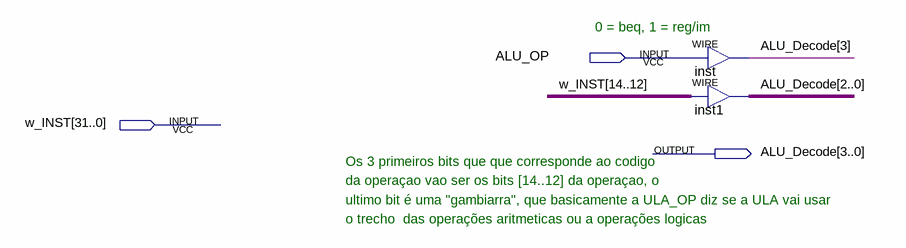
[diagram p0: schematic sheet]
// Quartus schematic ULA_Operador.bdf as structural Verilog: 2 symbols, 3 pins
module ULA_Operador (
  input  ALU_OP,
  input  [31:0] w_INST,
  output [3:0] ALU_Decode
);

  assign ALU_Decode[3] = ALU_OP;  // WIRE inst
  assign ALU_Decode[2:0] = w_INST[14:12];  // WIRE inst1

  // Notes on the sheet:
  //   0 = beq, 1 = reg/im
  //   Os 3 primeiros bits que que corresponde ao codigo
  //   da operaçao vao ser os bits [14..12] da operaçao, o
  //   ultimo bit é uma "gambiarra", que basicamente a ULA_OP diz se a ULA vai usar 
  //   o trecho  das operações aritmeticas ou a operações logicas
endmodule
